# EAGLE schematic RFID_MQTT_FINAL_ULTIMO_ULTIMO (EAGLE 7.6.0)
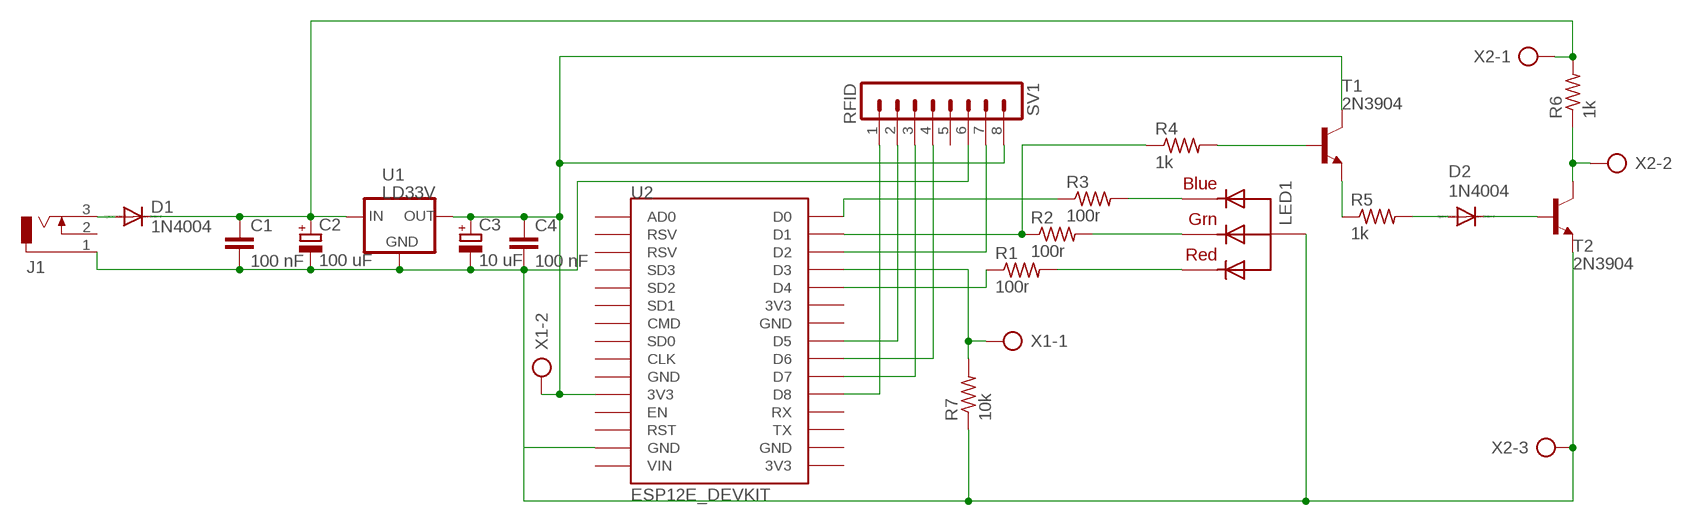
[diagram p0: schematic, sheet 1]

## Parts
C1  100 nF  C-EU050-024X044  [C050-024X044]
C2  100 uF  CPOL-EUE3.5-8  [E3,5-8]
C3  10 uF  CPOL-EUE3.5-8  [E3,5-8]
C4  100 nF  C-EU050-024X044  [C050-024X044]
D1  1N4004  [DO41-10]
D2  1N4004  [DO41-10]
J1  DCJ0202  [DCJ0202]
LED1  RGBLED_CA-5MM  [LED5MMRGB]
R1  100r  R-US_0207/7  [0207/7]
R2  100r  R-US_0207/7  [0207/7]
R3  100r  R-US_0207/7  [0207/7]
R4  1k  R-US_0207/7  [0207/7]
R5  1k  R-US_0207/7  [0207/7]
R6  1k  R-US_0207/7  [0207/7]
R7  10k  R-US_0207/7  [0207/7]
SV1  RFID  MA08-1  [MA08-1]
T1  2N3904  [TO92]
T2  2N3904  [TO92]
U1  LD33V  LD1117V33  [LD1117V33]
U2  ESP12E_DEVKIT  [ESP12E_DEVKIT]
X1  AK500/2-H  [AK500/2-H]
X2  AK500/3-H  [AK500/3-H]

## Nets
N$1: D1.A J1.3
N$2: C1.1 C2.+ D1.C R6.2 U1.IN X2.1
N$3: R4.2 T1.2(B)
N$4: C3.+ C4.1 SV1.8 T1.1(C) U1.OUT U2.3V3@0(3V3) X1.2
N$5: SV1.7 U2.D2
N$6: SV1.1 U2.D8
N$7: SV1.2 U2.D5
N$8: SV1.3 U2.D7
N$9: SV1.4 U2.D6
N$10: LED1.4(BLUE) R3.2
N$11: C1.2 C2.- C3.- C4.2 J1.1 LED1.2(VCC) R7.1 SV1.6 T2.3(E) U1.GND U2.GND@1(GND) X2.3
N$12: LED1.1(RED) R1.2
N$13: R3.1 U2.D0
N$14: R2.1 R4.1 U2.D1
N$15: R1.1 U2.D4
N$16: R5.1 T1.3(E)
N$17: D2.A R5.2
N$18: D2.C T2.2(B)
N$19: R6.1 T2.1(C) X2.2
N$20: LED1.3(GREEN) R2.2
N$21: R7.2 U2.D3 X1.1
Unconnected: J1.2 SV1.5 U2.3V3@1(3V3) U2.3V3@2(3V3) U2.AD0 U2.CLK U2.CMD U2.EN U2.GND@0(GND) U2.GND@2(GND) U2.GND@3(GND) U2.RST U2.RSV@0(RSV) U2.RSV@1(RSV) U2.RX U2.SD0 U2.SD1 U2.SD2 U2.SD3 U2.TX U2.VIN

## Library data of the parts
C1 C4 = rcl:C-EU: CAPACITOR, European symbol
C2 C3 = resistor:CPOL-EU: POLARIZED CAPACITOR, European symbol
D1 D2 = diode:1N4004: DIODE general purpose rectifier, 1 A
J1 = con-jack:DCJ0202: DC POWER JACK Source: DCJ0202.pdf; OC_FARNELL: unknown; OC_NEWARK: unknown
LED1 = adafruit:RGBLED_CA: RGB LED, common-anode 5MM Staggered pins 5mm Piranha package http://www.ladyada.net/library/pcb/eaglelibrary.html
R1-R7 = rcl:R-US_: RESISTOR, American symbol
SV1 = con-lstb:MA08-1: PIN HEADER; OC_FARNELL: unknown; OC_NEWARK: unknown
T1 T2 = transistor-neu-to92:2N3904: NPN TRANSISTOR
U1 = LD1117V33:LD1117V33
U2 = NODEMCU:ESP12E_DEVKIT: ESP12E DEVKIT BOARD
X1 = con-ptr500:AK500/2-H: CONNECTOR Aug. 2004 / PTR Meßtechnik: Die Bezeichnung der Serie AK505 wurde geändert. Es handelt sich hierbei um AK500 in horizontaler Ausführung.; OC_FARNELL: unknown; OC_NEWARK: unknown
X2 = con-ptr500:AK500/3-H: CONNECTOR Aug. 2004 / PTR Meßtechnik: Die Bezeichnung der Serie AK505 wurde geändert. Es handelt sich hierbei um AK500 in horizontaler Ausführung.; OC_FARNELL: unknown; OC_NEWARK: unknown